# Altium schematic sheet E17-15-IMD_LED.SchDoc
size A; DocumentNumber: 9; SheetNumber: 9; SheetTotal: 9
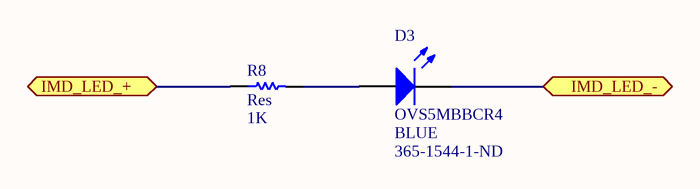
[diagram p0: E17-15-IMD_LED.SchDoc]

## Parts
D3  OVS5MBBCR4  Colour: BLUE  Supplier Part Number 1: 365-1544-1-ND  [OVS5MBBCR4]
R8  Res  value 1K  [3216[1206]]

## Ports
IMD_LED_+ (bidir), IMD_LED_- (bidir)

## Nets
IMD_LED_+: R8.1 ; port IMD_LED_+
IMD_LED_-: D3.2(K) ; port IMD_LED_-
NetD3_1: D3.1(A) R8.2

## Library data of the parts
D3 = OVS5MBBCR4: Typical BLUE LED; Published: 8-Jun-2000; LatestRevisionDate: 17-Jul-2002; LatestRevisionNote: Re-released for DXP Platform.; PackageDocument: Feb-2002; PackageReference: 3.2X1.6X1.1; Publisher: Altium Limited; Supplier 1: Digi-Key
R8 = Res: Surface Mount Resistor; Published: 8-Jun-2000; LatestRevisionDate: 17-Jul-2002; LatestRevisionNote: Re-released for DXP Platform.; PackageReference: AXIAL-0.5; Publisher: Altium Limited